# Altium schematic sheet LEDBoard.SchDoc
size A
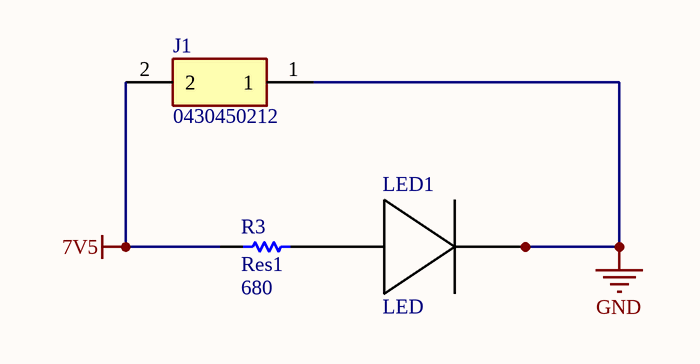
[diagram p0: LEDBoard.SchDoc]

## Parts
J1  0430450212  [0430450212]
LED1  LED  [L944-UV265-2-20]
R3  Res1  value 680  [6-0805_M]

## Nets
7V5: J1.2 R3.1
GND: J1.1 LED1.1 LED1.3
NetLED1_2: LED1.2 R3.2

## Library data of the parts
J1 = 0430450212: Connector; Manufacturer_Name: Molex; Datasheet Link: http://www.molex.com/pdm_docs/sd/430450212_sd.pdf; Manufacturer_Part_Number: 0430450212; Arrow Part Number: 0430450212; Arrow Price/Stock: https://www.arrow.com/en/products/0430450212/molex
R3 = Res1: Resistor; Published: 8-Jun-2000; LatestRevisionDate: 17-Jul-2002; LatestRevisionNote: Re-released for DXP Platform.; PackageReference: AXIAL-0.3; Publisher: Altium Limited; PackageDescription: Axial Device, Thru-Hole; 2 Leads; 0.3 in Pin Spacing